# Altium schematic sheet ADC_LevelConverter.SchDoc
size A4; SheetNumber: 4; SheetTotal: 4
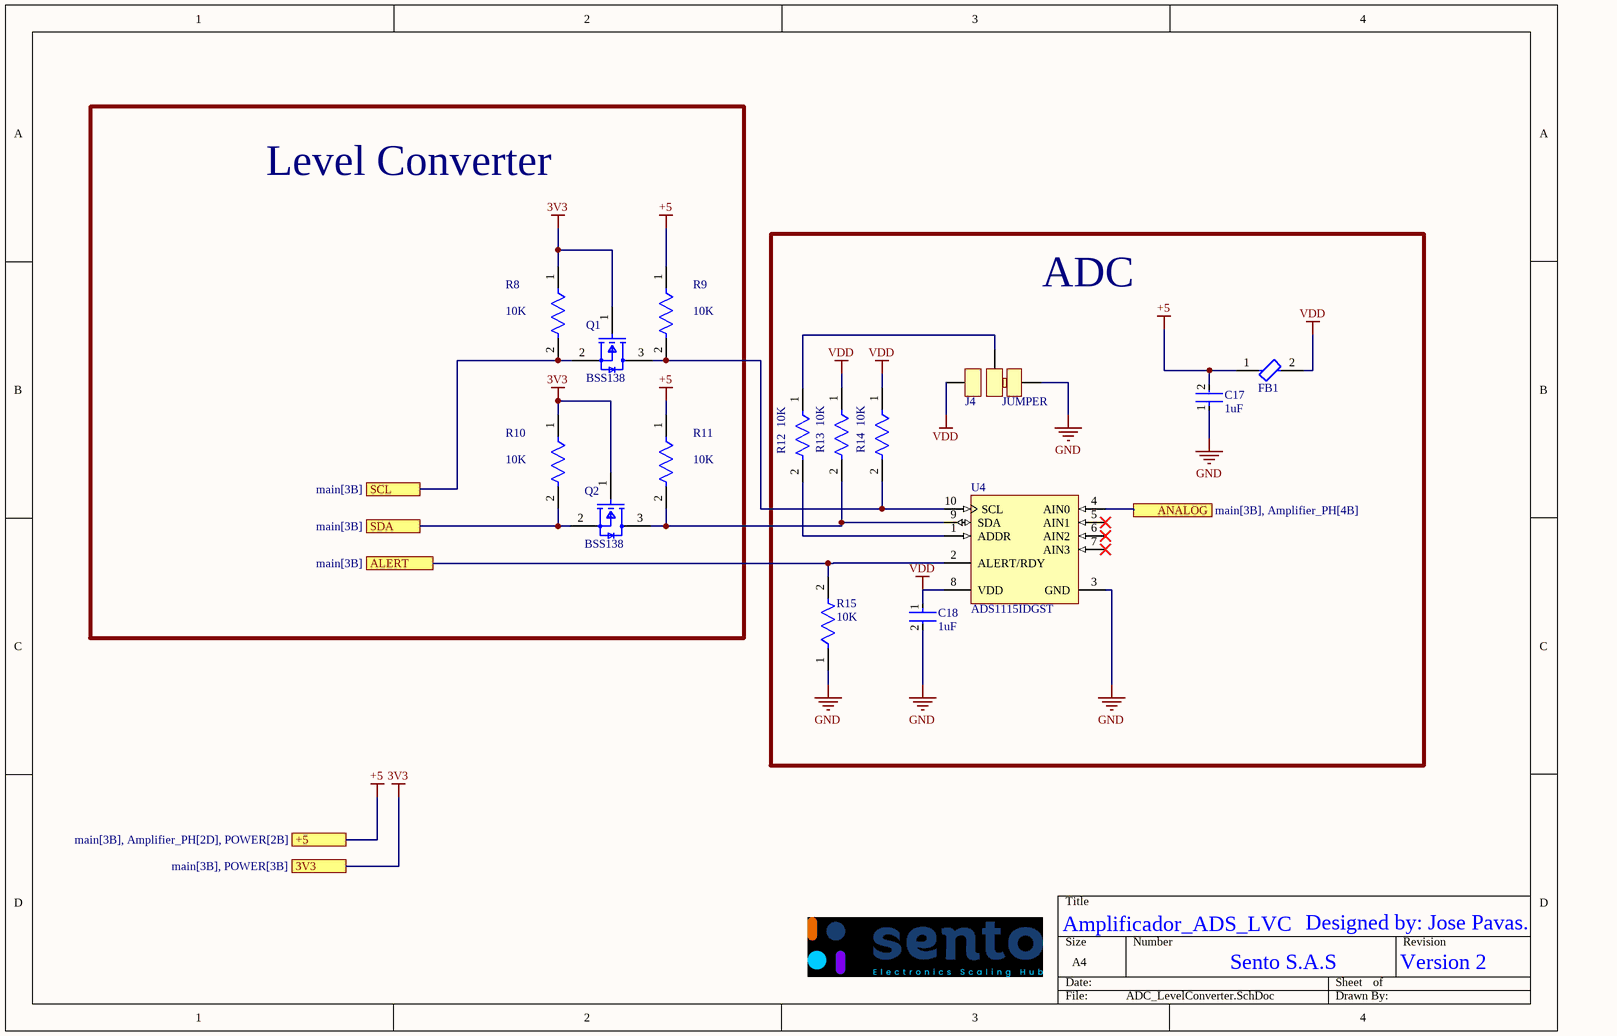
[diagram p0: ADC_LevelConverter.SchDoc]

## Parts
C17  1uF  [FP-CC0603-DA-MFG]
C18  1uF  [FP-CC0603-DA-MFG]
FB1  MMZ2012Y152BT000  [FP-MMZ2012-IPC_A]  (value not drawn)
J4  JUMPER  [Jumper 3 Pin]  (no BOM)
Q1  BSS138  [FP-318-08-IPC_B]
Q2  BSS138  [FP-318-08-IPC_B]
R8  10K  [FP-RC0603-0_55-IPC_C]
R9  10K  [FP-RC0603-0_55-IPC_C]
R10  10K  [FP-RC0603-0_55-IPC_C]
R11  10K  [FP-RC0603-0_55-IPC_C]
R12  10K  [FP-RC0603-0_55-IPC_C]
R13  10K  [FP-RC0603-0_55-IPC_C]
R14  10K  [FP-RC0603-0_55-IPC_C]
R15  10K  [FP-RC0603-0_55-IPC_C]
U4  ADS1115IDGST  [TI-DGS10_M]

## Blocks framed on the sheet
Level Converter: Q1 Q2 R8-R11
ADC: C17 C18 FB1 J4 R12-R15 U4

## Ports
3V3 (see main[3B], POWER[3B]), +5 (see main[3B], Amplifier_PH[2D], POWER[2B]), ALERT (see main[3B]), ANALOG (see main[3B], Amplifier_PH[4B]), SCL (see main[3B]), SDA (see main[3B])

## Nets
3V3: Q1.1(G) Q2.1(G) R8.1 R10.1 ; port 3V3
+5: C17.2 FB1.1 R9.1 R11.1 ; port +5
GND: C17.1 C18.2 J4.3 R15.1 U4.3(GND)
VDD: C18.1 FB1.2 J4.1 R13.1 R14.1 U4.8(VDD)
ALERT: R15.2 U4.2(ALERT/RDY) ; port ALERT
ANALOG: U4.4(AIN0) ; port ANALOG
SCL: Q1.2(S) R8.2 ; port SCL
SDA: Q2.2(S) R10.2 ; port SDA
NetJ4_2: J4.2 R12.1
NetQ1_3: Q1.3(D) R9.2 R14.2 U4.10(SCL)
NetQ2_3: Q2.3(D) R11.2 R13.2 U4.9(SDA)
NetR12_2: R12.2 U4.1(ADDR)

Not connected (* = marked no-connect by the designer): U4 5(AIN1)* 6(AIN2)* 7(AIN3)*

## Notes on the sheet
- Amplificador_ADS_LVC
- Sento S.A.S
- Designed by: Jose Pavas.
- Version 2

## Library data of the parts
C17 C18 = CMP-03422-000924-1: CAP CER 1UF 16V X7R 0603; Manufacturer: YAGEO; Manufacturer Part Number: CC0603KRX7R7BB105; Tolerance: 0.1; Temperature Coefficient: 15%; Material: Ceramic; Package: CC0603-DA; RoHS: TRUE; Device Class L2: Capacitors; Temperature Characteristic: X7R; Temperature: -55°C to +125°C; Temperature Range Low: -55°C; Automotive: No; ComponentLink2Description: Datasheet; Value: 1 uF; Lead Free: Yes; Capacitance: 1 uF; ComponentLink2URL: http://www.yageo.com/documents/recent/UPY-GPHC_X7R_6.3V-to-50V_18.pdf; Device Class L1: Passive Components; Voltage: 16 V; Octopart: https://octopart.com/cc0603krx7r7bb105-yageo-42271928; Category: Cap; Digikey Description: CAP CER 1UF 16V X7R 0603; Footprint Url: http://www.yageo.com/exep/pages/download/literatures/UPY-C_GEN_24.pdf; Height: 0.9mm; Voltage Rating: 16 V; Temperature Range High: +125°C; Mouser Description: Multilayer Ceramic Capacitor, CC Series, 1 - F, - 10%, X7R, 16 V, 0603 [1608 Metric]; Device Class L3: Ceramic Capacitors; LCSC Part Number: C15849
FB1 = CMP-08257-000286-1: Signal Line Ferrite Bead 1500Ω @ 100Mhz 500mA DCR 400mΩ SMD 0805; DC Resistance (DCR): 400mR; Impedance: 1.5kR; Current Rating: 500mA; Length: 0.079inch; Width: 0.049inch; Height: 0.041inch; Package Quantity: 4000; Series: MMZ; RoHS Compliant: Yes; Packaging: Cut Tape; Case Code (Metric): 2012; Case Code (Imperial): 0805; Max DC Current: 500mA; Case/Package: 0805; REACH SVHC: No SVHC; Mount: Surface Mount; LCSC Part Number: C275472
Q1 Q2 = CMP-07173-000101-1: MOSFET N-CH 50V 220MA SOT-23; Turn-Off Delay Time: 20ns; Element Configuration: Single; Rds On Max: 3.5R; Gate to Source Voltage (Vgs): 20V; Threshold Voltage: 1.3V; Number of Elements: 1; Power Dissipation: 360mW; Rise Time: 9ns; Turn-On Delay Time: 2.5ns; Input Capacitance: 27pF; On-State Resistance: 6R; Lead Free: Lead Free; Length: 2.92mm; Width: 1.3mm; Drain to Source Breakdown Voltage: 50V; Min Operating Temperature: -55°C; REACH SVHC: No SVHC; Packaging: Tape and Reel; Radiation Hardening: No; Height: 0.93mm; Drain to Source Voltage (Vdss): 50V; Current Rating: 220mA; Voltage Rating (DC): 50V; Weight: 0.03g; Continuous Drain Current (ID): 220mA; Number of Pins: 3; Nominal Vgs: 1.3V; Max Power Dissipation: 360mW; Fall Time: 9ns; Drain to Source Resistance: 3.5R; Contact Plating: Tin; Case/Package: SOT-23; Package Quantity: 1; Dual Supply Voltage: 50V; Mount: Surface Mount; Termination: SMD/SMT; Max Operating Temperature: 150°C; LCSC Part Number: C18195371
R8-R15 = CMP-2100-03664-2: RES 10K OHM 1% 1/10W 0603; Voltage Rating: 75V; Voltage Rating (DC): 50V; Resistance: 10kR; Power Rating: 100mW; Temperature Coefficient: 100ppm/°C; Depth: 0.8mm; Termination: SMD/SMT; Resistor Type: Thick Film; Series: RC; Construction: Rectangular; Features: Moisture Resistant; Packaging: Tape and Reel; Min Operating Temperature: -55°C; Number of Terminations: 2; Lead Pitch: 0.3mm; RoHS Compliant: Yes; Case/Package: 0603; Resistance Tolerance: 1%; Military Standard: Not; Weight: 7.1E-05oz; Number of Pins: 2; Tolerance: 1%; Length: 1.6mm; Case Code (Imperial): 0603; Lead Free: Lead Free; Width: 0.8mm; Max Power Dissipation: 100mW; Height: 0.45mm; Max Operating Temperature: 155°C; Case Code (Metric): 1608; Size Code: 0603; LCSC Part Number: C98220
U4 = CMP-0003-00378-2: 16-Bit ADC with Integrated Multiplexer, PGA, Comparator, Oscillator, and Reference, -40 to 125 degC, 10-pin SOP (DGS10), Green (RoHS & no Sb/Br); Manufacturer: Texas Instruments; Sample Rate (max)(SPS): 860; SubFamily: Precision ADC (<=10MSPS); Architecture: Delta-Sigma; Digital Supply(Min)(V): 2; Resolution(Bits): 16; Digital Supply(Max)(V): 5.5; INL(Max)(+/-LSB): 1; Interface: Serial I2C; # Input Channels: 4; Eco-Plan: Green (RoHS & no Sb/Br); PackageDescription: 10-Pin Plastic Small Outline, Body 3 x 3 mm, Pitch 0.5 mm; Mounting Technology: Surface Mount; PackageReference: DGS10; DatasheetVersion: SBAS444B; ComponentLink3Description: Package Specification; ComponentLink1Description: Manufacturer URL; PartNumber: ADS1115IDGST; ComponentLink3URL: http://www.ti.com/lit/ml/mpds035b/mpds035b.pdf; ComponentLink2URL: http://www.ti.com/general/docs/lit/getliterature.tsp?genericPartNumber=ADS1115&fileType=pdf; Analog Voltage AV/DD(Min)(V): 2; ComponentLink2Description: Datasheet; PackageVersion: 4073272/C, 02/2004; Analog Voltage AV/DD(Max)(V): 5.5; Code_JEDEC: MO-153; ComponentLink1URL: http://www.ti.com/; ComponentLink4Description: MOUSER; ComponentLink4URL: https://co.mouser.com/ProductDetail/Texas-Instruments/ADS1115IDGST?qs=6805eV47HhY3JIwOhQ2zog%3D%3D; LCSC Part Number: C37593